# Altium schematic sheet ПД1.SchDoc: Усилитель
size 420 x 297 mm; CheckedBy: Семенцов С.Г.; Author: Дорунц Ш.А.; Address1: Address1; Address2: Address2; Address3: Address3; Address4: Address4; DocumentNumber: ИУ4.11.03.03.23.05.09.001; SheetNumber: 3; SheetTotal: 4; Scale: 1:1; Title2str: Низких Частот; DocumentType: Схема измерительного стенда; FirstReferrence: ИУ4.11.03.03.23.05.52.09.001; UniversityName: МГТУ им. Н.Э. Баумана; DepartmentName: Кафедра ИУ4; GroupName: Группа ИУ4-52Б
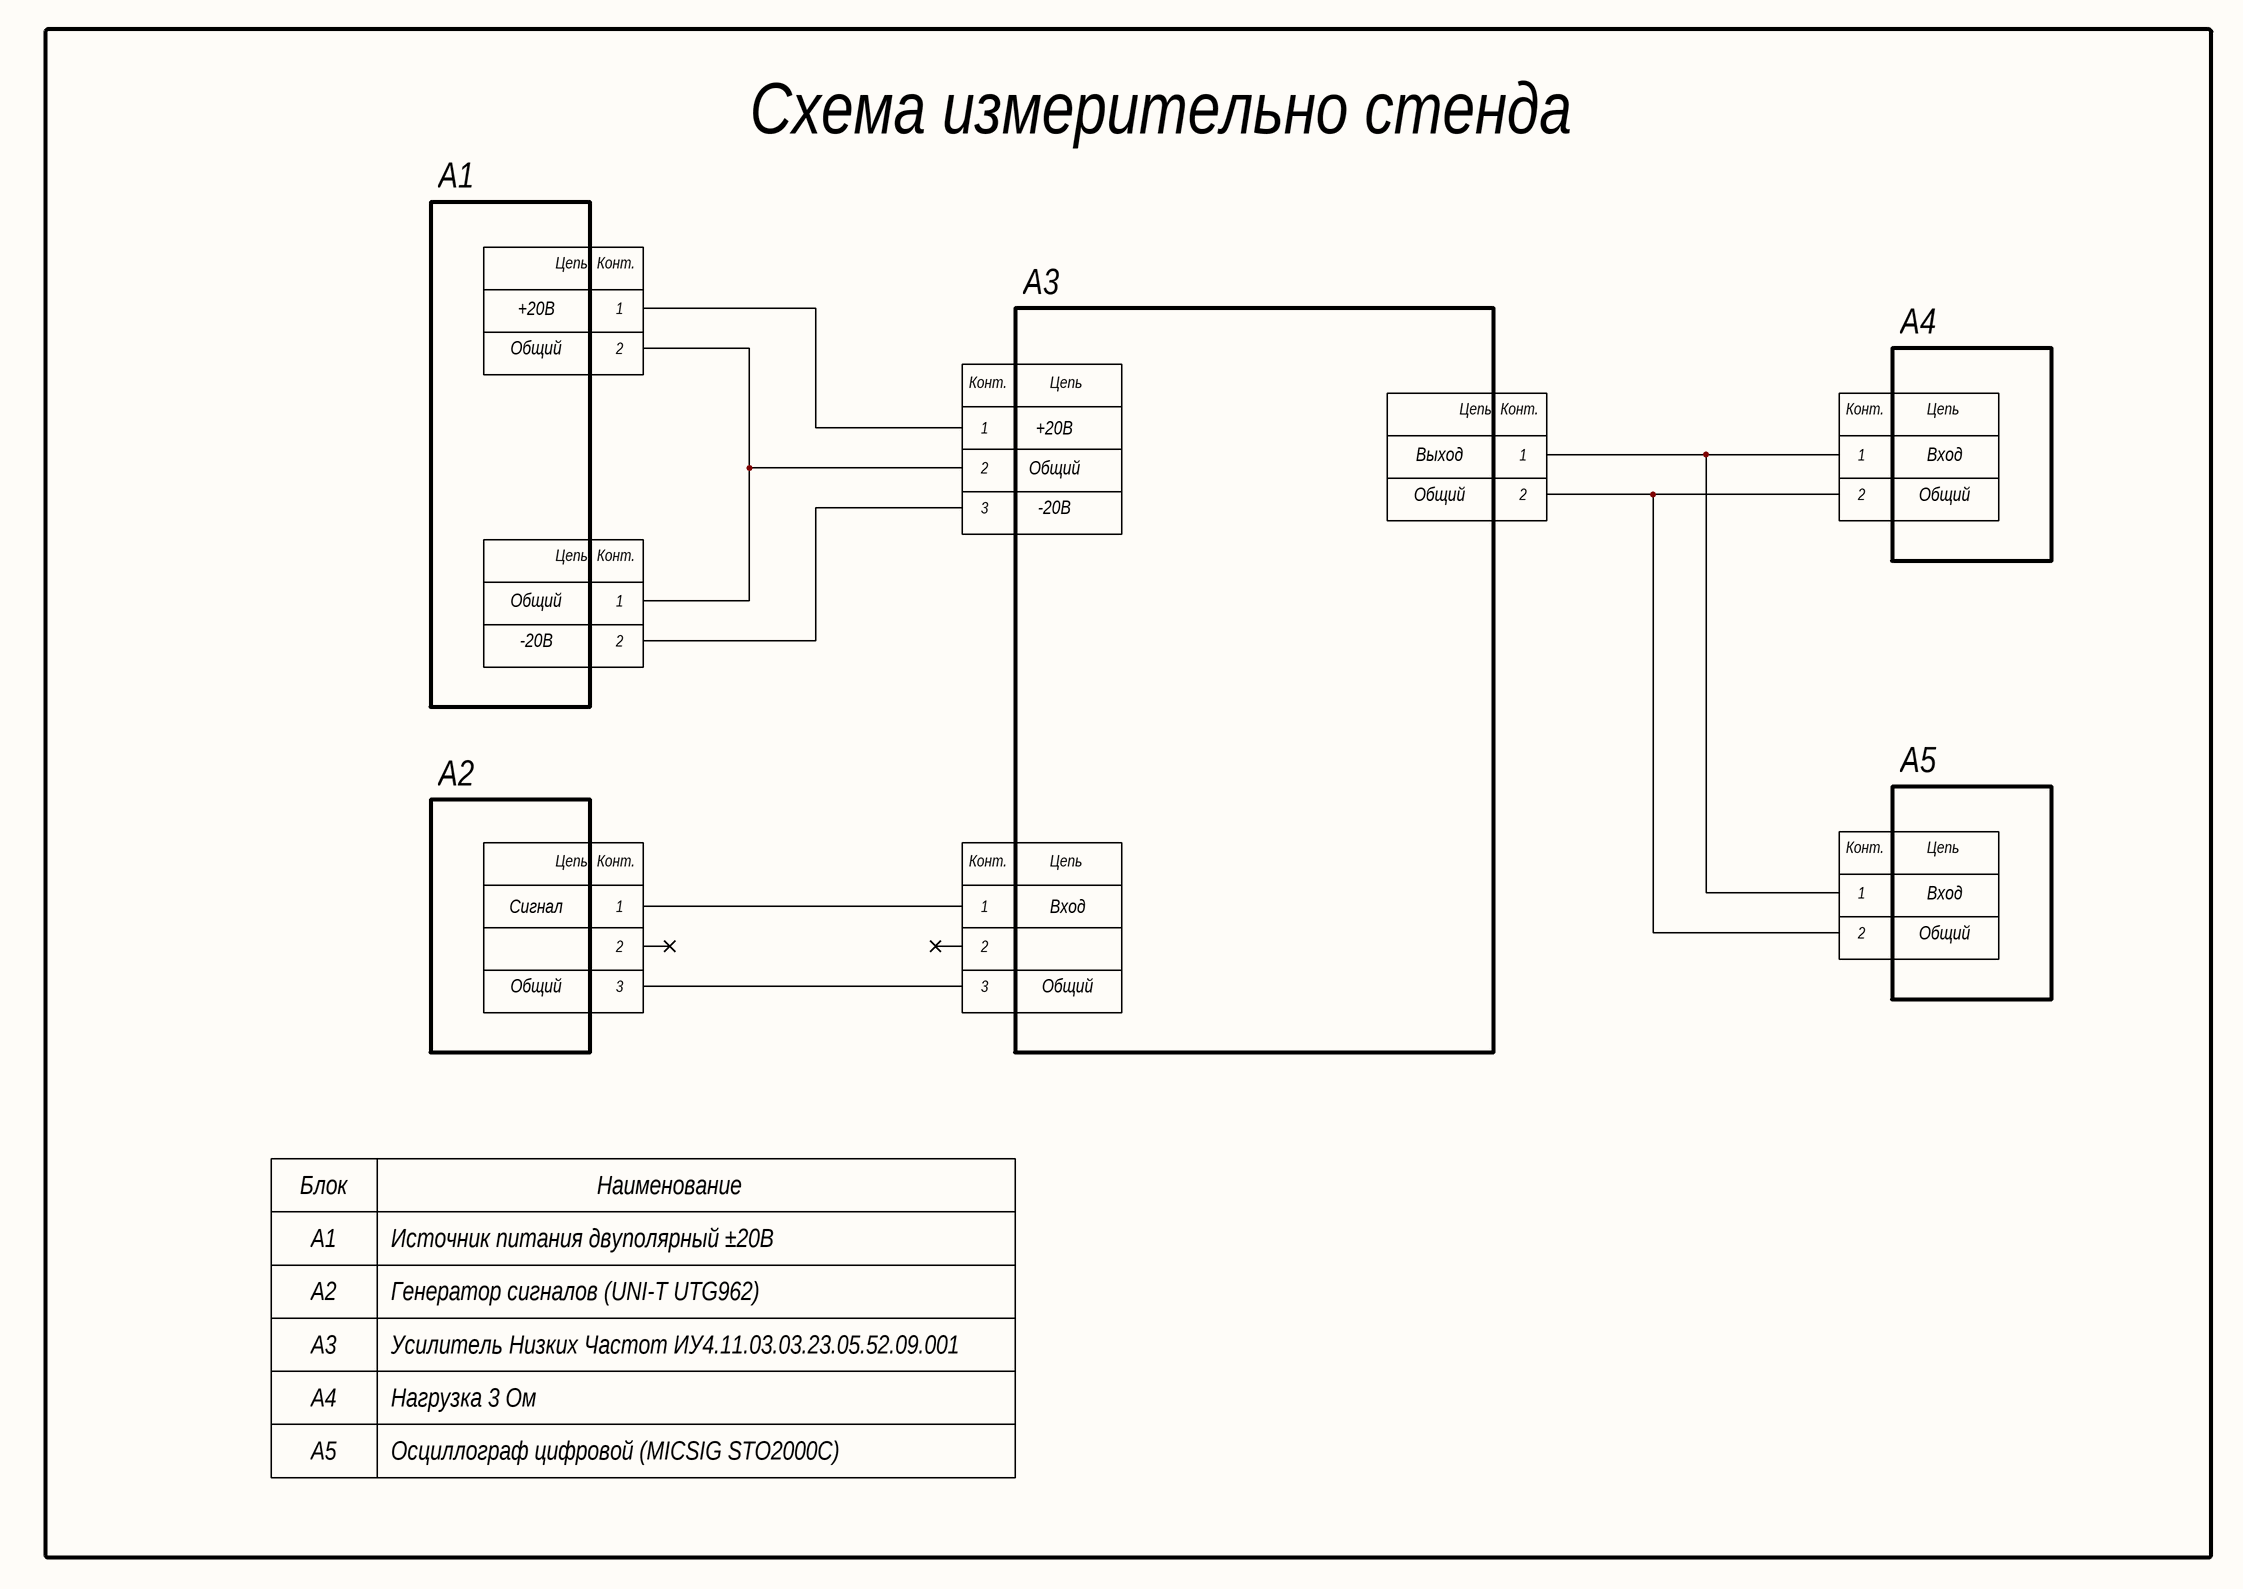
[diagram p0: ПД1.SchDoc]

## Parts
XS4  Connector 15EDGRC-3.81-02P  [15EDGRC-3.81-02P]  (value not drawn)
XS5  Connector 15EDGRC-3.81-03P  [15EDGRC-3.81-03P]  (value not drawn)
XS6  Connector 15EDGRC-3.81-02P  [15EDGRC-3.81-02P]  (value not drawn)
XS7  Connector 15EDGRC-3.81-02P  [15EDGRC-3.81-02P]  (value not drawn)
XS8  Connector 15EDGRC-3.81-02P  [15EDGRC-3.81-02P]  (value not drawn)
XS10  Connector 15EDGRC-3.81-02P  [15EDGRC-3.81-02P]  (value not drawn)
XS11  Connector ST-025  [ST-025]  (value not drawn)
XS?  Connector ST-025  [ST-025]  (value not drawn)

## Nets
NetXS4_1: XS4.1 XS5.1
NetXS4_2: XS4.2 XS5.2 XS8.1
NetXS5_3: XS5.3 XS8.2
NetXS6_1: XS6.1 XS7.1 XS10.1
NetXS6_2: XS6.2 XS7.2 XS10.2
NetXS11_1: XS11.1 XS?.1
NetXS11_3: XS11.3 XS?.3

Not connected (* = marked no-connect by the designer): XS11 2*; XS? 2*

## Notes on the sheet
- Схема измерительно стенда
- A1
- +20В
- А3
- А4
- Общий
- Выход
- Вход
- -20В
- A2
- А5
- Сигнал
- Блок
- Наименование
- А1
- Источник питания двуполярный ±20В
- А2
- Генератор сигналов (UNI-T UTG962)
- Усилитель Низких Частот ИУ4.11.03.03.23.05.52.09.001
- Нагрузка 3 Ом
- Осциллограф цифровой (MICSIG STO2000C)
- Перв. примен.
- Справ. №
- Подп. и дата
- Инв. № дубл.
- Взам. инв. №
- Разраб.
- Изм.
- Лист
- № докум.
- Подп.
- Дата
- Лит.
- Масса
- Масштаб
- Пров.
- Т.контр.
- Листов
- 1
- Инв. № подл.
- Утв.
- Н.контр.
- 2.106-A3
- Копировал
- Формат А3
- (in symbol Connector 15EDGRC-3.81-02P) Цепь; Конт.
- (in symbol Connector 15EDGRC-3.81-03P) Конт.; Цепь
- (in symbol Connector ST-025) Конт.; Цепь